# EAGLE design revision1-has-mistakes (EAGLE 6.6.0)
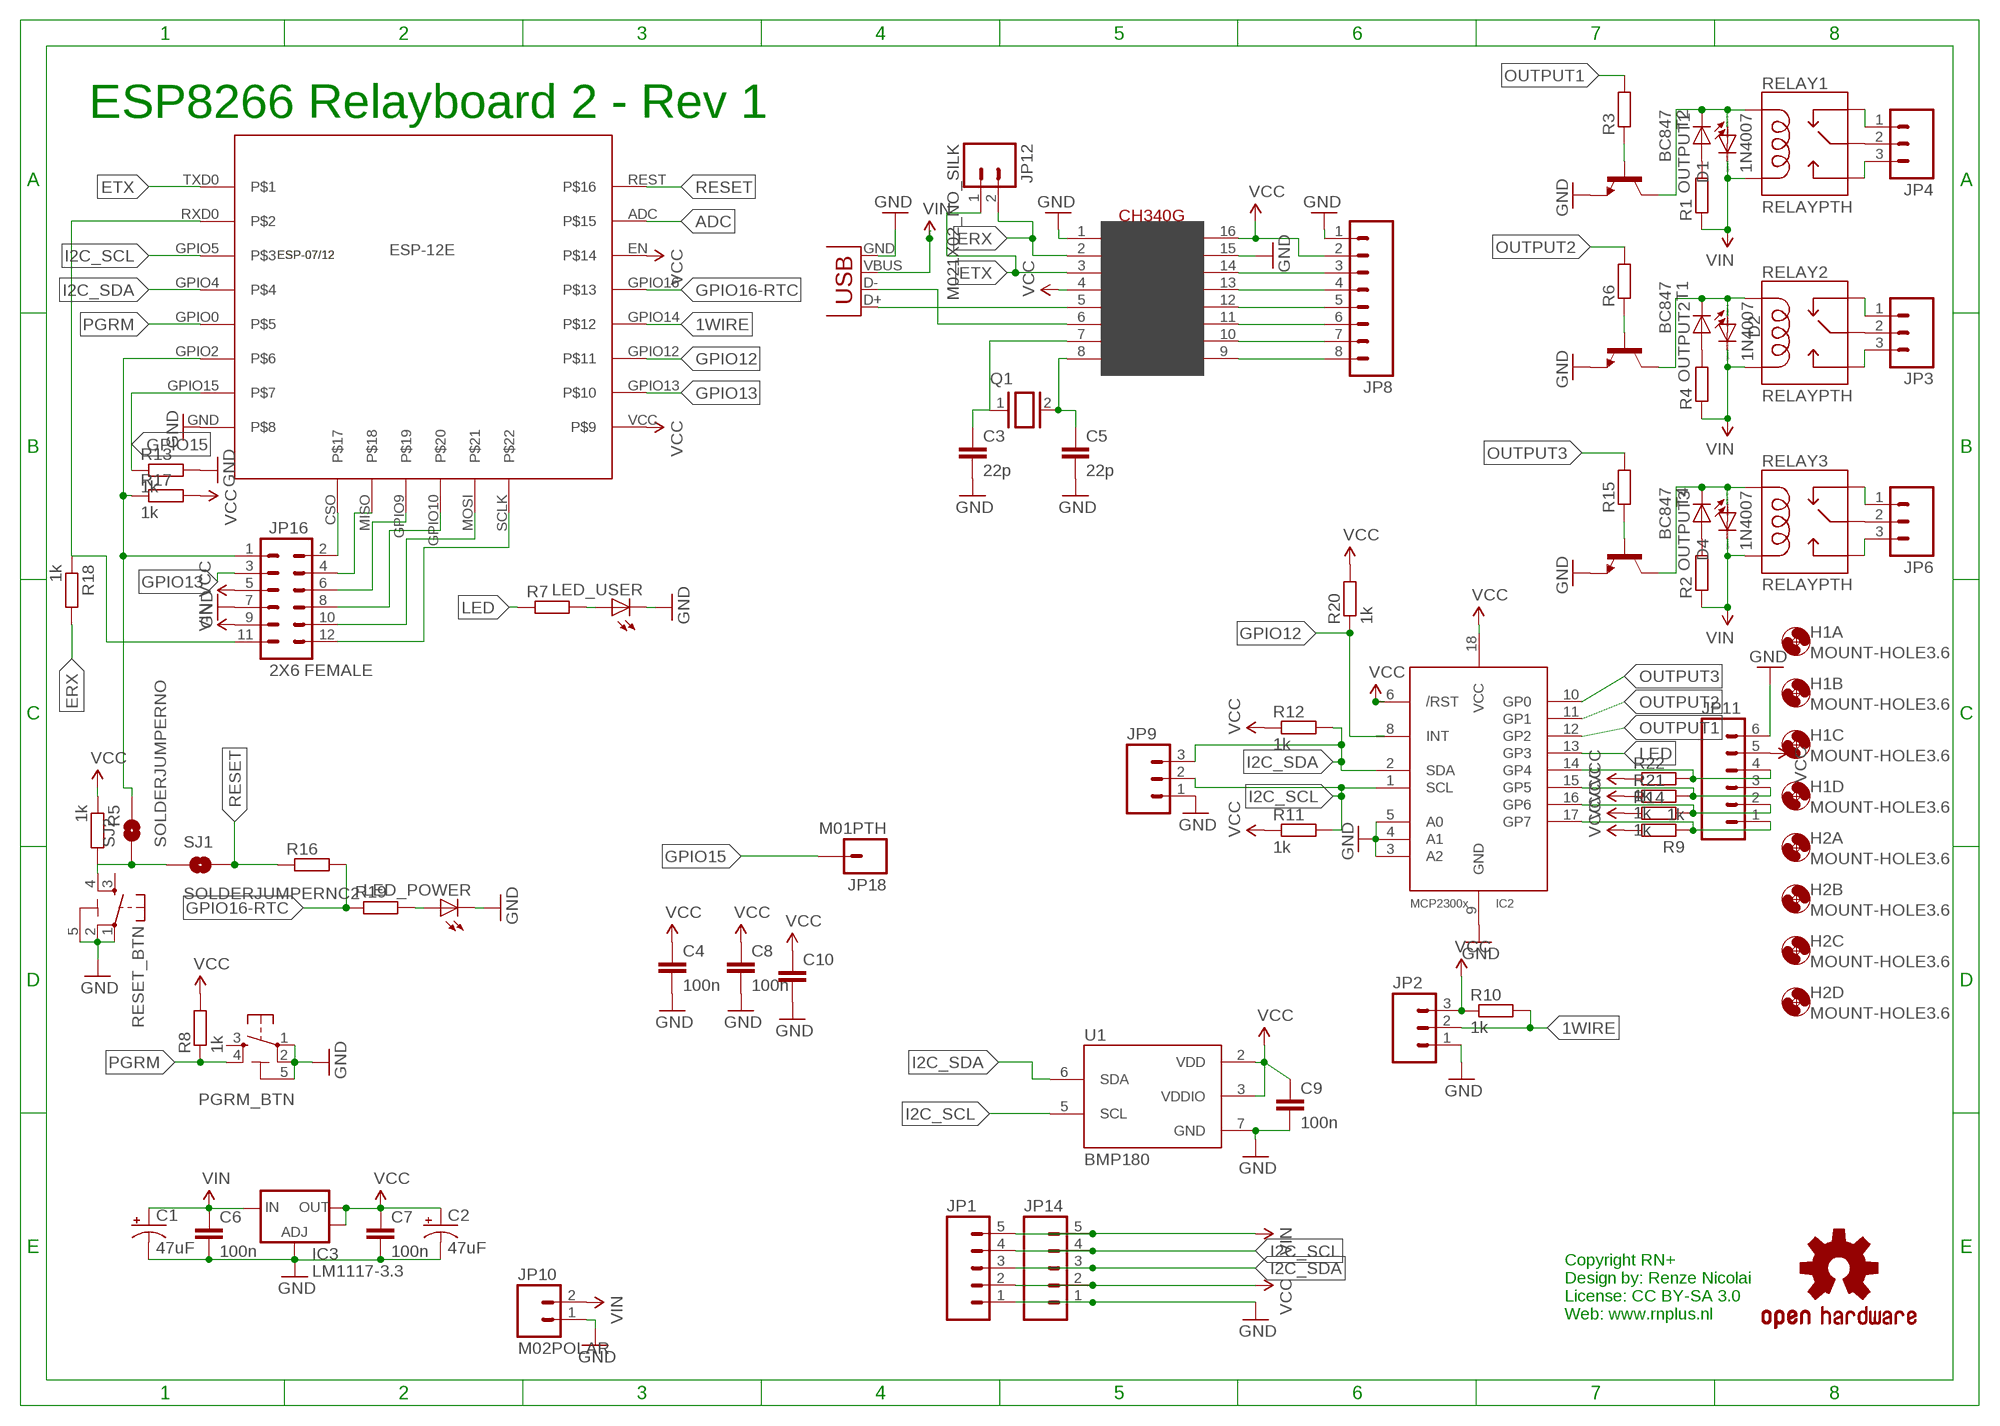
[diagram p0: schematic, sheet 1]

## Parts
C1  47uF  CAP_POLD  [PANASONIC_D]
C2  47uF  CAP_POLD  [PANASONIC_D]
C3  22p  C-EUC0805K  [C0805K]
C4  100n  C-EUC0805K  [C0805K]
C5  22p  C-EUC0805K  [C0805K]
C6  100n  C-EUC0805K  [C0805K]
C7  100n  C-EUC0805K  [C0805K]
C8  100n  C-EUC0805K  [C0805K]
C9  100n  C-EUC0805K  [C0805K]
C10  C-EUC0805K  [C0805K]
D1  1N4942  [DO41-10]
D2  1N4942  [DO41-10]
D4  1N4942  [DO41-10]
H1A  MOUNT-HOLE3.6  [3,6]
H1B  MOUNT-HOLE3.6  [3,6]
H1C  MOUNT-HOLE3.6  [3,6]
H1D  MOUNT-HOLE3.6  [3,6]
H2A  MOUNT-HOLE3.6  [3,6]
H2B  MOUNT-HOLE3.6  [3,6]
H2C  MOUNT-HOLE3.6  [3,6]
H2D  MOUNT-HOLE3.6  [3,6]
IC2  MCP23008/SO  [SO18W]
IC3  LM1117-3.3  V_REG_LM1117SOT223  [SOT223]
JP1  M05PTH  [1X05]
JP2  M03LONGPADS  [1X03_LONGPADS]
JP3  M03-SCREW-5MM  [SCREWTERMINAL-5MM-3]
JP4  M03-SCREW-5MM  [SCREWTERMINAL-5MM-3]
JP5  USB-B  USBPTH  [USB-B-PTH]
JP6  M03-SCREW-5MM  [SCREWTERMINAL-5MM-3]
JP8  M08SILK_FEMALE_PTH  [1X08]
JP9  M031X03_NO_SILK  [1X03_NO_SILK]
JP10  M02POLAR  [MOLEX-1X2]
JP11  M06LONGPADS  [1X06_LONGPADS]
JP12  M021X02_NO_SILK  [1X02_NO_SILK]
JP14  M05PTH  [1X05]
JP16  2X6 FEMALE  M06X2PTH_FEMALE  [2X6]
JP18  M01PTH  [1X01]
LED_POWER  LEDCHIP-LED0805  [CHIP-LED0805]
LED_USER  LEDCHIP-LED0805  [CHIP-LED0805]
LOGO1  OSHW-LOGOL  [OSHW-LOGO-L]
OUTPUT1  LEDCHIP-LED0805  [CHIP-LED0805]
OUTPUT2  LEDCHIP-LED0805  [CHIP-LED0805]
OUTPUT3  LEDCHIP-LED0805  [CHIP-LED0805]
PGRM_BTN  SMARTPRJ_TS42  [SMARTPRJ_TS42]
Q1  XTAL/S  [QS]
R1  SMARTPRJ_R-EU_M0805  [SMARTPRJ_M0805]
R2  SMARTPRJ_R-EU_M0805  [SMARTPRJ_M0805]
R3  SMARTPRJ_R-EU_M0805  [SMARTPRJ_M0805]
R4  SMARTPRJ_R-EU_M0805  [SMARTPRJ_M0805]
R5  1k  SMARTPRJ_R-EU_M0805  [SMARTPRJ_M0805]
R6  SMARTPRJ_R-EU_M0805  [SMARTPRJ_M0805]
R7  SMARTPRJ_R-EU_M0805  [SMARTPRJ_M0805]
R8  1k  SMARTPRJ_R-EU_M0805  [SMARTPRJ_M0805]
R9  1k  SMARTPRJ_R-EU_M0805  [SMARTPRJ_M0805]
R10  1k  SMARTPRJ_R-EU_M0805  [SMARTPRJ_M0805]
R11  1k  SMARTPRJ_R-EU_M0805  [SMARTPRJ_M0805]
R12  1k  SMARTPRJ_R-EU_M0805  [SMARTPRJ_M0805]
R13  1k  SMARTPRJ_R-EU_M0805  [SMARTPRJ_M0805]
R14  1k  SMARTPRJ_R-EU_M0805  [SMARTPRJ_M0805]
R15  SMARTPRJ_R-EU_M0805  [SMARTPRJ_M0805]
R16  SMARTPRJ_R-EU_M0805  [SMARTPRJ_M0805]
R17  1k  SMARTPRJ_R-EU_M0805  [SMARTPRJ_M0805]
R18  1k  SMARTPRJ_R-EU_M0805  [SMARTPRJ_M0805]
R19  SMARTPRJ_R-EU_M0805  [SMARTPRJ_M0805]
R20  1k  SMARTPRJ_R-EU_M0805  [SMARTPRJ_M0805]
R21  1k  SMARTPRJ_R-EU_M0805  [SMARTPRJ_M0805]
R22  1k  SMARTPRJ_R-EU_M0805  [SMARTPRJ_M0805]
RELAY1  RELAYPTH  [SRD-05VDC-SL-C]
RELAY2  RELAYPTH  [SRD-05VDC-SL-C]
RELAY3  RELAYPTH  [SRD-05VDC-SL-C]
RESET_BTN  SMARTPRJ_TS42  [SMARTPRJ_TS42]
SJ1  SOLDERJUMPERNC2  [SJ_2S-NOTRACE]
SJ2  SOLDERJUMPERNO  [SJ_2S-NO]
T1  BC847  [SOT23]
T2  BC847  [SOT23]
T4  BC847  [SOT23]
U1  BMP180  [BMP180]
U$1  CH340G  [SOIC16]
U$2  ESP-07/12_ESP-12E  [ESP-07/12]

## Nets
1WIRE: JP2.2 R10.2 U$2.GPIO14
ADC: U$2.ADC
ERX: JP12.2 R18.2 U$1.2(TX)
ERXR: JP16.11 R18.1 U$2.RXD0
ETX: JP12.1 U$1.3(RX) U$2.TXD0
GND: C1.- C2.- C3.2 C4.2 C5.2 C6.2 C7.2 C8.2 C9.2 C10.2 IC2.3(A2) IC2.4(A1) IC2.5(A0) IC2.9(GND) IC3.1(ADJ) JP1.1 JP2.1 JP5.GND JP8.1 JP9.1 JP10.1 JP11.6 JP14.1 JP16.7 LED_POWER.C LED_USER.C PGRM_BTN.1 PGRM_BTN.2 PGRM_BTN.5(5-GND) R13.2 RESET_BTN.1 RESET_BTN.2 RESET_BTN.5(5-GND) T1.2(E) T2.2(E) T4.2(E) U1.7(GND) U$1.1(GND) U$1.15(RS232) U$2.GND
GPIO12: IC2.8(INT) R20.1 U$2.GPIO12
GPIO13: JP16.3 U$2.GPIO13
GPIO15: JP18.1 R13.1 U$2.GPIO15
GPIO16-RTC: R16.2 R19.1 U$2.GPIO16
I2C_SCL: IC2.1(SCL) JP1.4 JP9.2 JP14.4 R11.2 U1.5(SCL) U$2.GPIO5
I2C_SDA: IC2.2(SDA) JP1.3 JP9.3 JP14.3 R12.2 U1.6(SDA) U$2.GPIO4
LED: IC2.13(GP3) R7.1
N$1: D2.A OUTPUT2.C RELAY2.COIL1 T1.3(C)
N$2: D1.A OUTPUT1.C RELAY1.COIL1 T2.3(C)
N$3: JP3.2 RELAY2.SWCOMMON
N$4: JP4.2 RELAY1.SWCOMMON
N$5: JP4.1 RELAY1.SWCLOSED(SWCLOSE)
N$6: JP4.3 RELAY1.SWOPEN
N$7: JP3.3 RELAY2.SWOPEN
N$8: JP3.1 RELAY2.SWCLOSED(SWCLOSE)
N$9: R3.1 T2.1(B)
N$10: R6.1 T1.1(B)
N$11: R5.2 RESET_BTN.4 SJ1.1 SJ2.1
N$13: OUTPUT2.A R4.2
N$14: IC2.14(GP4) JP11.4 R22.2
N$16: LED_USER.A R7.2
N$17: OUTPUT1.A R1.2
N$20: D4.A OUTPUT3.C RELAY3.COIL1 T4.3(C)
N$21: R15.1 T4.1(B)
N$27: IC2.15(GP5) JP11.3 R21.2
N$38: C3.1 Q1.1 U$1.7(XI)
N$39: OUTPUT3.A R2.2
N$41: C5.1 Q1.2 U$1.8(XO)
N$42: JP6.2 RELAY3.SWCOMMON
N$44: JP6.1 RELAY3.SWCLOSED(SWCLOSE)
N$45: JP6.3 RELAY3.SWOPEN
N$46: JP8.5 U$1.12(DCD)
N$47: JP8.4 U$1.13(DTR)
N$48: JP8.3 U$1.14(RTS)
N$49: JP8.8 U$1.9(CTS)
N$50: JP8.7 U$1.10(DSR)
N$51: JP8.6 U$1.11(RI)
N$56: LED_POWER.A R19.2
N$60: JP16.2 U$2.CSO
N$61: JP16.4 U$2.MISO
N$63: JP16.6 U$2.GPIO9
N$64: JP16.8 U$2.GPIO10
N$65: JP16.10 U$2.MOSI
N$66: JP16.12 U$2.SCLK
N$69: JP16.1 R17.1 SJ2.2 U$2.GPIO2
OUTPUT1: IC2.12(GP2) R3.2
OUTPUT2: IC2.11(GP1) R6.2
OUTPUT3: IC2.10(GP0) R15.2
PGRM: PGRM_BTN.4 R8.1 U$2.GPIO0
RESET: R16.1 SJ1.2 U$2.REST
SENSOR1: IC2.16(GP6) JP11.2 R14.2
SENSOR2: IC2.17(GP7) JP11.1 R9.1
USB_N: JP5.D- U$1.6(D-)
USB_P: JP5.D+ U$1.5(D+)
VCC: C2.+ C4.1 C7.1 C8.1 C9.1 C10.1 IC2.6(/RST) IC2.18(VCC) IC3.2(OUT) IC3.4(OUT) JP1.2 JP2.3 JP8.2 JP11.5 JP14.2 JP16.5 R5.1 R8.2 R9.2 R10.1 R11.1 R12.1 R14.1 R17.2 R20.2 R21.1 R22.1 U1.2(VDD) U1.3(VDDIO) U$1.4(V3) U$1.16(VCC) U$2.EN U$2.VCC
VIN: C1.+ C6.1 D1.C D2.C D4.C IC3.3(IN) JP1.5 JP5.VBUS JP10.2 JP14.5 JP16.9 R1.1 R2.1 R4.1 RELAY1.COIL0 RELAY2.COIL0 RELAY3.COIL0
Unconnected: PGRM_BTN.3 RESET_BTN.3

## Notes on the sheet
- ESP8266 Relayboard 2 - Rev 1
- 1N4007
- 1N4007
- 1N4007
- Copyright RN+
  Design by: Renze Nicolai
  License: CC BY-SA 3.0
  Web: www.rnplus.nl

## Library data of the parts
C1 C2 = SparkFun-Capacitors:CAP_POL: Capacitor Polarized These are standard SMD and PTH capacitors. Normally 10uF, 47uF, and 100uF in electrolytic and tantalum varieties. Always verify the external diameter of the through hole cap, it varies with capacity, voltage, and manufacturer. The EIA devices should be standard.
C3-C10 = rcl:C-EU: CAPACITOR, European symbol
D1 D2 D4 = diode:1N4942: DIODE 1.0 A, 200 V, 150 ns
H1A H1B H1C H1D H2A H2B H2C H2D = holes:MOUNT-HOLE: MOUNTING HOLE with drill center marker
IC2 = adafruit:MCP23008: MCP23008 Inexpensive i2c i/o expander - 8 general purpose i/o pins with optional pullups
IC3 = SparkFun-PowerIC:V_REG_LM1117: Voltage Regulator LM1117 Standard adjustable voltage regulator but in SMD form. Spark Fun Electronics SKU : COM-00595
JP1 JP14 = SparkFun-Connectors:M05: Header 5 Standard 5-pin 0.1" header. Use with straight break away headers (SKU : PRT-00116), right angle break away headers (PRT-00553), swiss pins (PRT-00743), machine pins (PRT-00117), and female headers (PRT-00115). Molex polarized connector foot print use with SKU : PRT-08230 with associated crimp pins and housings.
JP2 JP9 = SparkFun-Connectors:M03: Header 3 Standard 3-pin 0.1" header. Use with straight break away headers (SKU : PRT-00116), right angle break away headers (PRT-00553), swiss pins (PRT-00743), machine pins (PRT-00117), and female headers (PRT-00115). Molex polarized connector foot print use with SKU : PRT-08232 with associated crimp pins and housings.
JP3 JP4 JP6 = SparkFun-Connectors:M03: Header 3 Standard 3-pin 0.1" header. Use with straight break away headers (SKU : PRT-00116), right angle break away headers (PRT-00553), swiss pins (PRT-00743), machine pins (PRT-00117), and female headers (PRT-00115). Molex polarized connector foot print use with SKU : PRT-08232 with associated crimp pins and housings.; STOREFRONT_ID: PRT-08433
JP5 = SparkFun-Connectors:USB: USB Connectors USB-B-PTH is fully proven SKU : PRT-00139/CONN-08278 USB-miniB is fully proven SKU : PRT-00587 USB-A-PCB is untested. USB-A-H is throughly reviewed, but untested. Spark Fun Electronics SKU : PRT-00437 USB-B-SMT is throughly reviewed, but untested. Needs silkscreen touching up. USB-A-S has not been used/tested USB-MB-H has not been used/tested USB-MICROB has been used. CONN-09505; PROD_ID: CONN-08278
JP8 = SparkFun-Connectors:M08: Header 8 Standard 8-pin 0.1" header. Use with straight break away headers (SKU : PRT-00116), right angle break away headers (PRT-00553), swiss pins (PRT-00743), machine pins (PRT-00117), and female headers (PRT-00115).; PROD_ID: CONN-08438
JP10 JP12 = SparkFun-Connectors:M02: Standard 2-pin 0.1" header. Use with - straight break away headers ( PRT-00116) - right angle break away headers (PRT-00553) - swiss pins (PRT-00743) - machine pins (PRT-00117) - female headers (PRT-00115) Molex polarized connector foot print use with: PRT-08233 with associated crimp pins and housings. 2.54_SCREWTERM for use with PRT-10571. 3.5mm Screw Terminal footprints for PRT-08084 5mm Screw Terminal footprints for use with PRT-08432
JP11 = SparkFun-Connectors:M06: Header 6 Standard 6-pin 0.1" header. Use with straight break away headers (SKU : PRT-00116), right angle break away headers (PRT-00553), swiss pins (PRT-00743), machine pins (PRT-00117), and female headers (PRT-00115). Molex polarized connector foot print use with SKU : PRT-08094 with associated crimp pins and housings. NOTES ON THE VARIANTS LOCK and LOCK_LONGPADS... This footprint was designed to help hold the alignment of a through-hole component (i.e. 6-pin header) while soldering it into place. You may notice that each hole has been shifted either up or down by 0.005 of an inch from it's more standard position (which is a perfectly straight line). This slight alteration caused the pins (the squares in the middle) to touch the edges of the holes. Because they are alternating, it causes a "brace" to hold the component in place. 0.005 has proven to be the perfect amount of "off-center" position when using our standard breakaway headers. Although looks a little odd when you look at the bare footprint, once you have a header in there, the alteration is very hard to notice. Also,if you push a header all the way into place, it is covered up entirely on the bottom side. This idea of altering the position of holes to aid alignment will be further integrated into the Sparkfun Library for other footprints. It can help hold any component with 3 or more connection pins.
JP16 = SparkFun-Connectors:M06X2; PROD_ID: CONN-12423
JP18 = SparkFun-Connectors:M01: Header 1 Standard 1-pin 0.1" header. Use with straight break away headers (SKU : PRT-00116), right angle break away headers (PRT-00553), swiss pins (PRT-00743), machine pins (PRT-00117), and female headers (PRT-00115).
LED_POWER LED_USER OUTPUT1-OUTPUT3 = led:LED: LED OSRAM: - CHIPLED LG R971, LG N971, LY N971, LG Q971, LY Q971, LO R971, LY R971 LH N974, LH R974 LS Q976, LO Q976, LY Q976 LO Q996 - Hyper CHIPLED LW Q18S LB Q993, LB Q99A, LB R99A - SideLED LS A670, LO A670, LY A670, LG A670, LP A670 LB A673, LV A673, LT A673, LW A673 LH A674 LY A675 LS A676, LA A676, LO A676, LY A676, LW A676 LS A679, LY A679, LG A679 - Hyper Micro SIDELED® LS Y876, LA Y876, LO Y876, LY Y876 LT Y87S - SmartLED LW L88C, LW L88S LB L89C, LB L89S, LG L890 LS L89K, LO L89K, LY L89K LS L896, LA L896, LO L896, LY L896 - TOPLED LS T670, LO T670, LY T670, LG T670, LP T670 LSG T670, LSP T670, LSY T670, LOP T670, LYG T670 LG T671, LOG T671, LSG T671 LB T673, LV T673, LT T673, LW T673 LH T674 LS T676, LA T676, LO T676, LY T676, LB T676, LH T676, LSB T676, LW T676 LB T67C, LV T67C, LT T67C, LS T67K, LO T67K, LY T67K, LW E67C LS E67B, LA E67B, LO E67B, LY E67B, LB E67C, LV E67C, LT E67C LW T67C LS T679, LY T679, LG T679 LS T770, LO T770, LY T770, LG T770, LP T770 LB T773, LV T773, LT T773, LW T773 LH T774 LS E675, LA E675, LY E675, LS T675 LS T776, LA T776, LO T776, LY T776, LB T776 LHGB T686 LT T68C, LB T68C - Hyper Mini TOPLED® LB M676 - Mini TOPLED Santana® LG M470 LS M47K, LO M47K, LY M47K Source: http://www.osram.convergy.de LUXEON: - LUMILED® LXK2-PW12-R00, LXK2-PW12-S00, LXK2-PW14-U00, LXK2-PW14-V00 LXK2-PM12-R00, LXK2-PM12-S00, LXK2-PM14-U00 LXK2-PE12-Q00, LXK2-PE12-R00, LXK2-PE12-S00, LXK2-PE14-T00, LXK2-PE14-U00 LXK2-PB12-K00, LXK2-PB12-L00, LXK2-PB12-M00, LXK2-PB14-N00, LXK2-PB14-P00, LXK2-PB14-Q00 LXK2-PR12-L00, LXK2-PR12-M00, LXK2-PR14-Q00, LXK2-PR14-R00 LXK2-PD12-Q00, LXK2-PD12-R00, LXK2-PD12-S00 LXK2-PH12-R00, LXK2-PH12-S00 LXK2-PL12-P00, LXK2-PL12-Q00, LXK2-PL12-R00 Source: www.luxeon.com KINGBRIGHT: KA-3528ASYC Source: www.kingbright.com
LOGO1 = SparkFun-Aesthetics:OSHW-LOGO: Open Source Hardware Logo This logo indicates the piece of hardware it is found on incorporates a OSHW license and/or adheres to the definition of open source hardware found here: http://freedomdefined.org/OSHW
PGRM_BTN RESET_BTN = arduino_Uno_Rev3-02-TH:SMARTPRJ_TS42: TS42 Dongnan Electronics Tact switch VDC 12V - 50mA
Q1 = special:XTAL/S: CRYSTAL
R1-R22 = arduino_Uno_Rev3-02-TH:SMARTPRJ_R-EU_: RESISTOR, European symbol
RELAY1-RELAY3 = srd-05vdc-sl-c:RELAY: SPDT relay (COM-00101)
SJ1 SJ2 = SparkFun-Retired:SOLDERJUMPER: Solder Jumper Standard SMD solder jumper. Used to automate production. Two varients : Normally Open and Normally Closed are the same, but have different paste layers. NC will have a large amount of paste and should jumper during reflow.
T1 T2 T4 = transistor:BC847: NPN TRANSISTOR
U1 = SparkFun-Sensors:BMP180: BOSCH BMP180 DIGITAL BAROMETRIC PRESSURE SENSOR Web page: http://www.bosch-sensortec.com/en/homepage/products_3/environmental_sensors_1/bmp180_1/bmp180 Datasheet: http://ae-bst.resource.bosch.com/media/products/dokumente/bmp180/BST-BMP180-DS000-09.pdf The BMP180 is the function compatible successor of the BMP085, a new generation of high precision digital pressure sensors for consumer applications. The ultra-low power, low voltage electronics of the BMP180 is optimized for use in mobile phones, PDAs, GPS navigation devices and outdoor equipment. With a low altitude noise of merely 0.25m at fast conversion time, the BMP180 offers superior performance. The I2C interface allows for easy system integration with a microcontroller. The BMP180 is based on piezo-resistive technology for EMC robustness, high accuracy and linearity as well as long term stability. Key features: - Temperature measurement included - I2C interface - Fully calibrated - Pb-free, halogen-free and RoHS compliant, - MSL 1 Basic specs: Pressure range: 300 to 1100hPa (+9000m to -500m relating to sea level) Supply voltage: 1.8 to 3.6V (VDD), 1.62V to 3.6V (VDDIO) Package: LGA package with metal lid Small footprint: 3.6mm x 3.8mm Super-flat: 0.93mm height Low power: 5μA at 1 sample / sec. in standard mode Low noise: 0.06hPa (0.5m) in ultra low power mode, 0.02hPa (0.17m) advanced resolution mode Typical applications: - Enhancement of GPS navigation (dead-reckoning, slope detection, etc.) - In- and out-door navigation - Leisure and sports - Weather forecast - Vertical velocity indication (rise/sink speed)
U$1 = usb-serial:CH340G
U$2 = ESP-12E:ESP-07/12: Version 1.0 of the library for the ESP-07/12 full GPIO dev board module byME Jon jonnyradu@gmail.com

## Net classes
0 default: clearance 0.205 mm

## Board
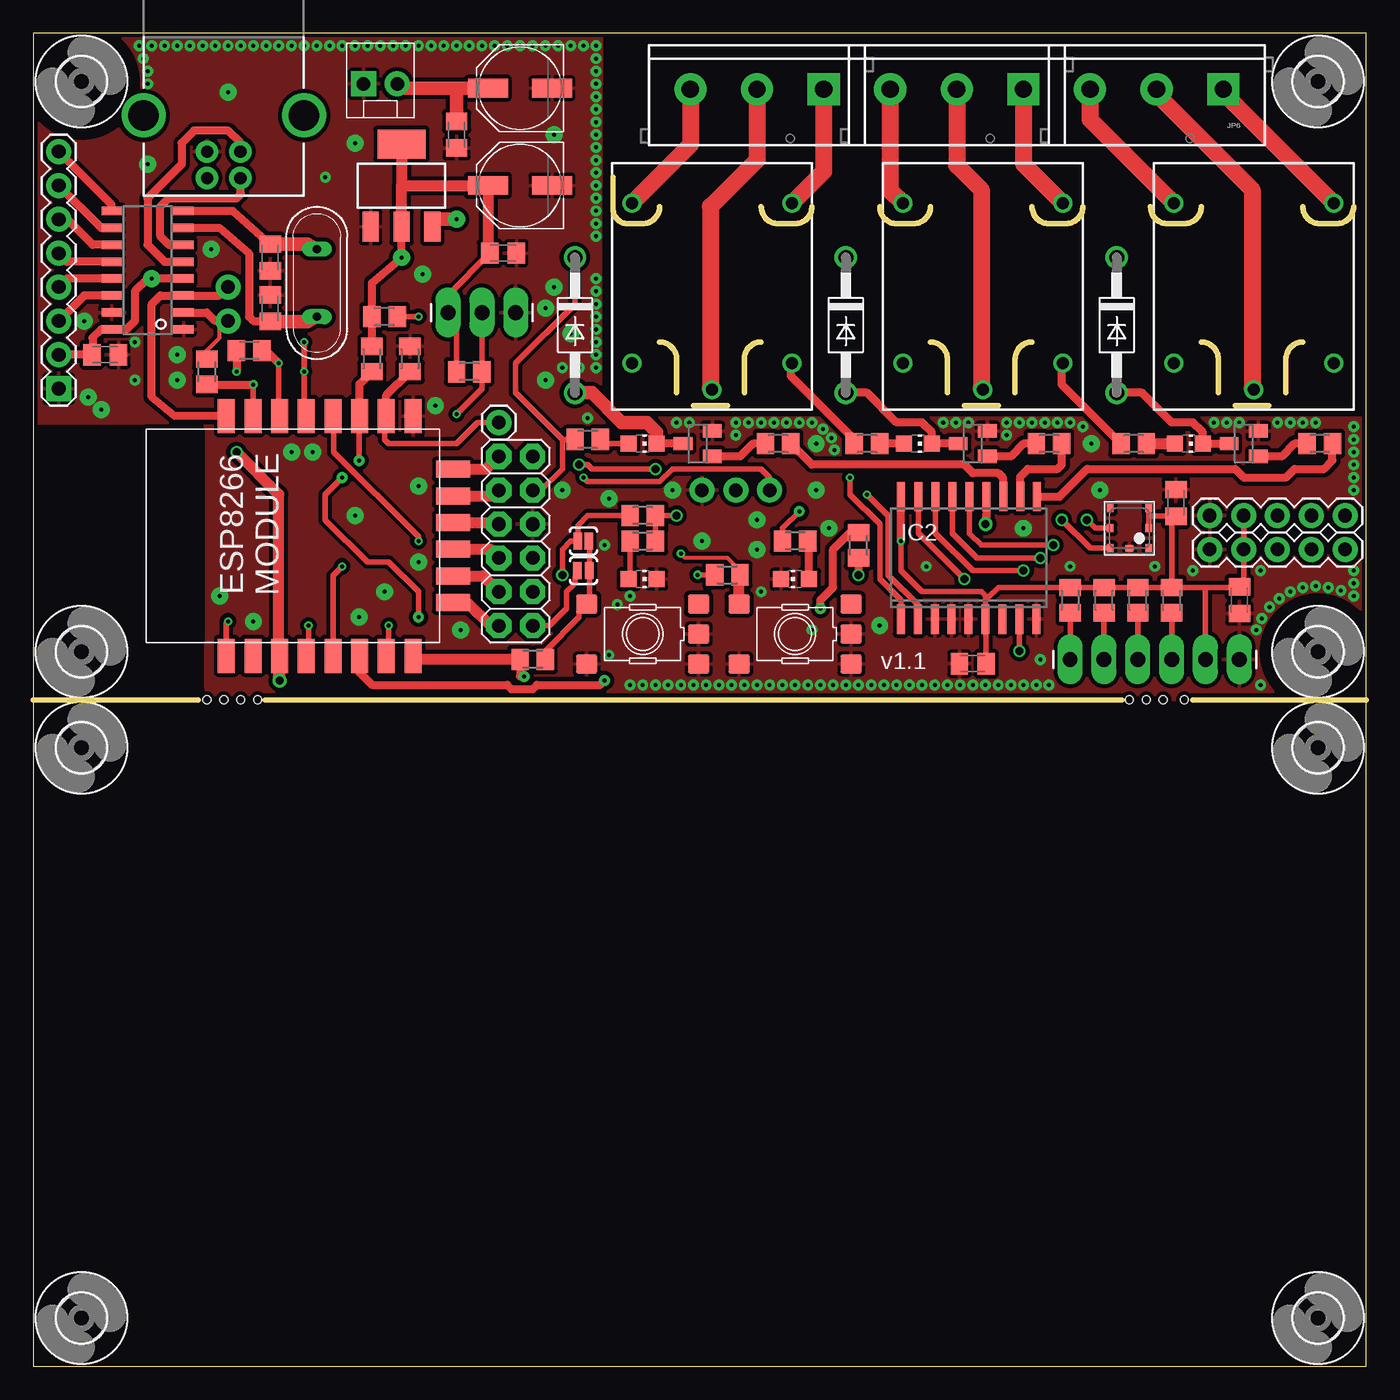
[diagram p1: board, top side]
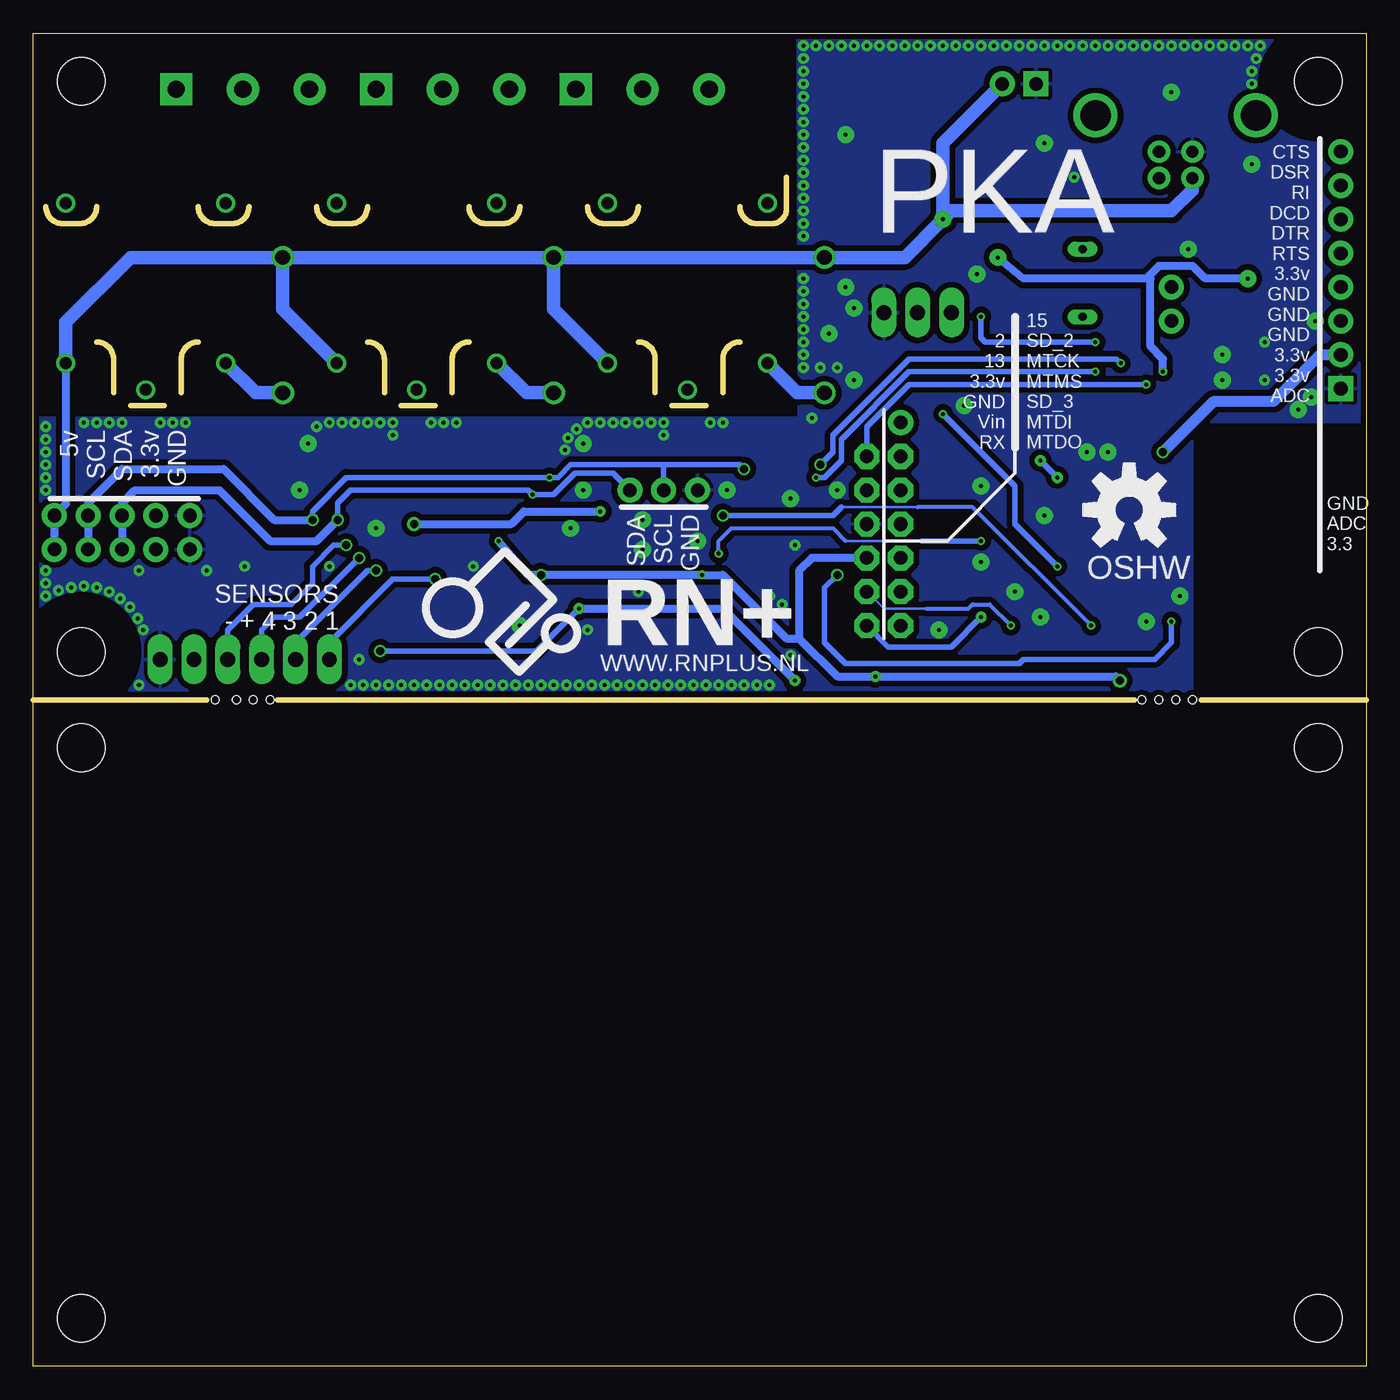
[diagram p2: board, bottom side, seen from below]

Size 100 x 100 mm. Coordinates in mm from the lower left corner, seen from the top.
Outline: 100,50 100,0 0,0 0,50
Outline: 100,50 100,100 0,100 0,50
Outline: 58.42,87 arc-90 57.15,85.72 55.88,85.72 arc-90 54.61,87
Outline: 46.99,87 arc-90 45.72,85.72 44.45,85.72 arc-90 43.5,87 43.5,89.22
Outline: 53.34,73.03 53.34,75.56 arc-90 54.61,76.83
Outline: 48.26,73.03 48.26,75.56 arc90 46.99,76.83
Outline: 68.58,73.03 68.58,75.56 arc90 67.31,76.83
Outline: 73.66,73.03 73.66,75.56 arc-90 74.93,76.83
Outline: 67.31,87 arc-90 66.04,85.72 64.77,85.72 arc-90 63.5,87
Outline: 78.74,87 arc-90 77.47,85.72 76.2,85.72 arc-90 74.93,87
Outline: 83.82,87 arc90 85.09,85.72 86.36,85.72 arc90 87.63,87
Outline: 99.06,87 arc-90 97.79,85.72 96.52,85.72 arc-90 95.25,87
Outline: 88.9,73.03 88.9,75.56 arc90 87.63,76.83
Outline: 93.98,73.03 93.98,75.56 arc-90 95.25,76.83
Outline: 12.38,50 0,50
Outline: 17.38,50 81.67,50
Outline: 100,50 86.98,50
Outline: 52.07,72.07 49.53,72.07
Outline: 72.39,72.07 69.85,72.07
Outline: 92.71,72.07 90.17,72.07
Copper layers (1*16): Top 0.035mm / dielectric 1.5mm / Bottom 0.035mm
Design rules "dirt_cheap_dirty_boards.v1": minimum track width 5mil, minimum drill 12mil, track to track 5mil, track to pad 5mil, pad to pad 5mil, via to via 5mil, smd to smd 0mil, copper to edge 10mil, drill to drill 10mil, minimum pad ring 10mil, minimum via ring 6mil, stop-mask expansion 2mil, vias tented up to drill 25mil, thermal gap 10mil
Holes 0.6 mm at 13.02,50 14.29,50 15.56,50 82.23,50 83.5,50 16.83,50 84.77,50 86.36,50
tRestrict: area 0,50.8 to 12.5,70.3
bRestrict: area 0,50.8 to 12.5,70.3

### Footprints (pad centres in the part's own frame; a part is rotated, then mirrored left to right if it is on the bottom)
PANASONIC_D = smd 3 x 1.4: + 2.4,0; - -2.4,0
C0805K = smd 1.3 x 1.6: 1 -1,0; 2 1,0
DO41-10 = drill 1.118: A 5.08,0; C -5.08,0
3,6 = hole 3.6: 0,0
SO18W = smd 0.6 x 2.2: 1 -4.445,-4.6; 2 -3.175,-4.6; 3 -1.905,-4.6; 4 -0.635,-4.6; 5 0.635,-4.6; 6 1.905,-4.6; 7 3.175,-4.6; 8 4.445,-4.6; 9 5.715,-4.6; 10 5.775,4.6; 11 4.505,4.6; 12 3.235,4.6; 13 1.965,4.6; 14 0.695,4.6; 15 -0.575,4.6; 16 -1.845,4.6; 17 -3.145,4.6; 18 -4.445,4.6
SOT223 = smd 1.219 x 2.235: 1 -2.311,-3.099; 2 0,-3.099; 3 2.311,-3.099 | smd 3.6 x 2.2: 4 0,3.099
1X05 = drill 1.016 pad 1.88: 1 0,0; 2 2.54,0; 3 5.08,0; 4 7.62,0; 5 10.16,0
1X03_LONGPADS = drill 1.118 pad 1.88 long: 1 0,0; 2 2.54,0; 3 5.08,0
SCREWTERMINAL-5MM-3 = drill 1.3 pad 2.413 square: 1 0,0 | drill 1.3 pad 2.413: 2 5,0; 3 10,0
USB-B-PTH = drill 0.914 pad 1.676: D+ 0,1.25; D- 1.981,1.25; GND 0,-1.25; VBUS 1.981,-1.25 | drill 2.286: S1 -2.718,-6.02; S2 -2.718,6.02
1X08 = drill 1.016 pad 1.88 square: 1 0,0 | drill 1.016 pad 1.88: 2 2.54,0; 3 5.08,0; 4 7.62,0; 5 10.16,0; 6 12.7,0; 7 15.24,0; 8 17.78,0
1X03_NO_SILK = drill 1.016 pad 1.88: 1 0,0; 2 2.54,0; 3 5.08,0
MOLEX-1X2 = drill 1.016 pad 1.88 square: 1 0,0 | drill 1.016 pad 1.88: 2 2.54,0
1X06_LONGPADS = drill 1.118 pad 1.88 long: 1 0,0; 2 2.54,0; 3 5.08,0; 4 7.62,0; 5 10.16,0; 6 12.7,0
1X02_NO_SILK = drill 1.016 pad 1.88: 1 0,0; 2 2.54,0
2X6 = drill 1.016 pad 1.88 octagon: 1 0,0; 2 0,2.54; 3 2.54,0; 4 2.54,2.54; 5 5.08,0; 6 5.08,2.54; 7 7.62,0; 8 7.62,2.54; 9 10.16,0; 10 10.16,2.54; 11 12.7,0; 12 12.7,2.54
1X01 = drill 1.016 pad 1.88: 1 0,0
CHIP-LED0805 = smd 1.2 x 1.2: A 0,-1.05; C 0,1.05
SMARTPRJ_TS42 = smd 1.6 x 1.4: 1 -4.2,2.25; 2 4.2,2.25; 3 -4.2,-2.25; 4 4.2,-2.25; 5 -4.2,0
QS = drill 0.61 long: 1 -2.54,0; 2 2.54,0
SMARTPRJ_M0805 = smd 1.3 x 1.6: 1 -0.95,0; 2 0.95,0
SRD-05VDC-SL-C = drill 0.9: COIL0 -5.39,-6.12; COIL1 -5.39,5.88; SWCLOSED 6.61,-6.12; SWCOMMON -7.39,-0.12; SWOPEN 6.61,5.88
SJ_2S-NOTRACE = smd 0.635 x 1.27: 1 -0.401,0; 2 0.413,0
SJ_2S-NO = smd 0.635 x 1.27: 1 -0.45,0; 2 0.45,0
SOT23 = smd 1 x 1.4: 1 -0.95,-1.1; 2 0.95,-1.1; 3 0,1.1
BMP180 = smd 0.6 x 0.5: 1 1.5,1.45; 2 0,1.45; 3 -1.5,1.45; 4 -1.5,-1.45; 5 0,-1.45; 6 1.5,-1.45 | smd 0.5 x 0.6: 7 1.5,0
SOIC16 = smd 0.635 x 1.524: 1 -4.445,-2.695; 2 -3.175,-2.695; 3 -1.905,-2.695; 4 -0.635,-2.695; 5 0.635,-2.695; 6 1.905,-2.695; 7 3.175,-2.695; 8 4.445,-2.695; 9 4.445,2.695; 10 3.175,2.695; 11 1.905,2.695; 12 0.635,2.695; 13 -0.635,2.695; 14 -1.905,2.695; 15 -3.175,2.695; 16 -4.445,2.695
ESP-07/12 = smd 2.54 x 1.27: ADC -1,14; EN -1,12; GND 17,2; GPIO0 17,8; GPIO2 17,6; GPIO4 17,10; GPIO5 17,12; GPIO12 -1,6; GPIO13 -1,4; GPIO14 -1,8; GPIO15 17,4; GPIO16 -1,10; REST -1,16; RXD0 17,14; TXD0 17,16; VCC -1,2 | smd 1.27 x 2.54: CSO 3,-1; GPIO9 7,-1; GPIO10 9,-1; MISO 5,-1; MOSI 11,-1; SCLK 13,-1

### Placement (x,y rotation side)
C1  36.51,95.89 180 top
C2  36.51,88.58 180 top
C3  17.78,79.38 90 top
C4  5.4,75.88 0 top
C5  17.78,83.19 270 top
C6  31.75,92.39 270 top
C7  35.24,83.5 0 top
C8  90.49,57.47 270 top
C9  85.72,64.77 90 top
C10  70.48,52.7 180 top
D1  40.64,78.11 270 top
D2  60.96,78.11 270 top
D4  81.28,78.11 270 top
H1A  3.6,3.6 0 top
H1B  96.4,3.6 0 top
H1C  3.6,46.4 0 top
H1D  96.4,46.4 0 top
H2A  3.6,53.6 0 top
H2B  96.4,53.6 0 top
H2C  3.6,96.4 0 top
H2D  96.4,96.4 0 top
IC2  69.53,60.64 0 top
IC3  27.62,88.58 0 top
JP1  88.27,63.82 0 top
JP2  36.2,79.06 180 top
JP3  74.29,95.81 180 top
JP4  59.29,95.81 180 top
JP5  14.29,91.12 270 top
JP6  89.28,95.81 180 top
JP8  1.91,73.34 90 top
JP9  50.16,65.72 0 top
JP10  24.77,96.2 0 top
JP11  77.79,53.02 0 top
JP12  14.61,80.96 270 top
JP14  88.27,61.28 0 top
JP16  37.47,55.56 90 top
JP18  34.92,70.8 0 top
LED_POWER  45.72,59.05 270 top
LED_USER  57.15,59.05 90 top
LOGO1  17.78,64.24 0 bottom
OUTPUT1  45.72,69.22 270 top
OUTPUT2  66.36,69.22 270 top
OUTPUT3  86.68,69.22 270 top
PGRM_BTN  57.15,54.93 180 top
Q1  21.27,81.28 90 top
R1  41.59,69.53 0 top
R2  82.55,69.22 0 top
R3  55.88,69.22 0 top
R4  62.55,69.22 0 top
R5  37.47,53.02 0 top
R6  76.2,69.22 0 top
R7  57.15,61.91 0 top
R8  52.07,59.37 180 top
R9  77.79,57.47 90 top
R10  32.7,74.61 0 top
R11  16.19,76.2 0 top
R12  26.35,78.74 0 top
R13  28.26,75.56 90 top
R14  80.33,57.47 270 top
R15  96.52,69.22 0 top
R16  45.72,63.82 0 top
R17  25.4,75.56 90 top
R18  13.02,74.61 90 top
R19  45.72,61.91 180 top
R20  61.91,61.59 270 top
R21  82.87,57.47 270 top
R22  85.41,57.47 270 top
RELAY1  50.8,80.64 90 top
RELAY2  71.12,80.64 90 top
RELAY3  91.44,80.64 90 top
RESET_BTN  45.72,54.93 180 top
SJ1  41.27,61.91 180 top
SJ2  41.27,59.69 180 top
T1  70.48,69.22 90 top
T2  49.85,69.22 90 top
T4  90.81,69.22 90 top
U1  82.23,62.87 270 top
U$1  8.57,82.23 90 top
U$2  30.48,54.29 90 top

### Tracks (layer width: path | path; a pad name or v marks a point on that pad's centre or on a via)
1WIRE  (via drill 0.3 pad 0.61)
  Top 0.406: U$2.GPIO14 22.48,59.31 v23.18,60.01 | v31.75,71.44 33.66,73.34 33.66,73.66 | 33.66,73.66 JP2.2 | R10.2 33.65,73.66 33.66,73.66
  Bottom 0.406: v31.75,71.44 26.35,66.04 26.35,63.18 v23.18,60.01
ERX
  Top 0.305: R18.2 12.38,75.56 13.97,77.15 13.97,77.79 JP12.2
  Top 0.61: U$1.2 13.02,79.06 13.65,78.42 JP12.2
ERXR  (via drill 0.3 pad 0.61)
  Top 0.406: U$2.RXD0 16.48,73.63 v16.51,73.66
  Top 0.61: R18.1 v16.51,73.66
  Bottom 0.406: v16.51,73.66 34.29,73.66 37.47,70.48 JP16.11
ETX
  Top 0.61: U$2.TXD0 10.62,71.29 8.89,72.71 8.89,79.69 9.53,80.33 U$1.3 13.97,80.33 JP12.1
GND  (via drill 0.3 pad 0.81, 0.3 pad 1.27)
  other vias: 43.18,65.09 14.61,95.57 21.91,89.22 29.21,81.92 63.5,55.56 47.94,65.72 58.74,65.72 38.42,73.98 39.05,80.96 39.05,92.39 79.38,69.22 58.74,69.22 54.29,63.5 26.35,58.1 8.57,90.17 28.89,66.04 19.37,68.58 16.51,55.88 20.95,68.58 24.13,63.82 54.29,61.28 13.97,57.78 13.34,83.82 24.13,91.76 59.69,62.87 76.2,51.12 87,59.69 84.14,60.01 92.08,59.69 74.3,62.87 80.01,65.72 78.74,70.48 52.7,69.85 88.58,70.8 99.06,70.48 8.89,99.06 19.37,99.06 42.23,99.06 28.89,60.33 32.07,55.24 24.45,56.2 43.81,57.15 39.69,65.72 42.23,75.88 10.79,75.88 10.79,73.98 48.26,70.8 77.79,60.01 99.06,66.67 99.06,68.58 99.06,67.63 99.06,69.53 99.06,65.72 99.06,59.69 99.06,58.74 99.06,57.78 98.11,58.2 97.16,58.42 96.2,58.52 95.25,58.42 94.3,58.1 93.48,57.59 92.75,56.96 92.16,56.1 91.76,55.24 92.08,51.12 96.2,70.8 95.25,70.8 94.3,70.8 93.34,70.8 89.53,70.8 90.49,70.8 77.79,70.8 76.83,70.8 75.88,70.8 74.93,70.8 73.98,70.8 73.03,70.8 73.03,69.85 75.25,51.12 74.3,51.12 73.34,51.12 72.39,51.12 71.44,51.12 70.48,51.12 69.53,51.12 68.58,51.12 67.63,51.12 66.67,51.12 65.72,51.12 64.77,51.12 63.82,51.12 62.87,51.12 61.91,51.12 60.96,51.12 60.01,51.12 59.05,51.12 58.1,51.12 57.15,51.12 56.2,51.12 55.24,51.12 54.29,51.12 53.34,51.12 52.39,51.12 51.44,51.12 50.48,51.12 49.53,51.12 48.58,51.12 47.62,51.12 46.67,51.12 45.72,51.12 66.99,60.01 44.77,51.12 58.42,55.24 42.23,98.11 42.23,97.16 42.23,96.2 42.23,95.25 42.23,94.3 42.23,93.34 42.23,92.39 42.23,91.44 42.23,90.49 42.23,89.53 42.23,88.58 42.23,87.63 42.23,86.68 42.23,85.72 42.23,84.77 50.16,61.91 44.77,57.78 42.86,61.59 54.61,58.1 43.18,53.34 42.23,81.6 42.23,80.64 42.23,79.69 42.23,78.74 42.23,77.79 42.23,76.83 42.23,74.93 41.59,71.12 49.21,70.8 58.42,70.8 57.47,70.8 56.52,70.8 55.56,70.8 54.61,70.8 53.66,70.8 52.7,70.8 59.25,70.31 59.88,69.65 60.1,68.75 68.26,70.8 69.22,70.8 70.17,70.8 41.27,99.06 40.32,99.06 39.37,99.06 38.42,99.06 37.47,99.06 36.51,99.06 35.56,99.06 34.61,99.06 33.66,99.06 32.7,99.06 31.75,99.06 30.8,99.06 29.84,99.06 28.89,99.06 27.94,99.06 26.99,99.06 26.04,99.06 25.08,99.06 24.13,99.06 23.18,99.06 22.23,99.06 21.27,99.06 20.32,99.06 18.41,99.06 17.46,99.06 16.51,99.06 15.56,99.06 14.61,99.06 13.65,99.06 12.7,99.06 11.75,99.06 10.79,99.06 9.84,99.06 7.94,99.06 8.26,98.11 8.57,97.16 8.57,96.2 75.56,53.02 4.13,72.71 40.96,74.93 39.69,74.93 38.42,79.38 40.32,77.47 3.81,78.42 30.16,72.07 7.62,73.98 5.08,71.75 7.62,76.83
  pour Top (isolate 0.305): 0,99.92 42.63,99.92 42.55,84.68 42.55,71.12 100.01,71.12 100.01,50 0.08,50.08 0.03,69.98 0,69.98
  pour Bottom (isolate 0.432): 100.01,50 0,50.05 0,69.98 -0.03,69.93 -0.03,70.46 0,99.92 42.63,99.92 42.55,71.12 100.01,71.12
GPIO12  (via drill 0.3 pad 0.81, 0.6 pad 0.81)
  Top 0.406: IC2.8 v73.98,53.66
  Top 0.61: U$2.GPIO12 24.48,52.04 25.4,51.12 35.56,51.12 35.88,50.8 37.47,50.8 37.78,51.12 42.55,51.12 v42.86,51.44 | v59.05,56.83 59.05,57.47 60.01,58.42 60.01,61.28 61.28,62.55 R20.1
  Bottom 0.406: v73.98,53.66 62.23,53.66 v59.05,56.83
  Bottom 0.61: v59.05,56.83 48.26,56.83 v42.86,51.44
GPIO13  (via drill 0.3 pad 0.61)
  Top 0.406: v26.67,55.56 26.67,53.48 U$2.GPIO13
  Bottom 0.2: JP16.3 36.2,56.83 33.02,56.83
  Bottom 0.305: v26.67,55.56 28.26,57.15 29.53,57.15 29.84,56.83 33.02,56.83
GPIO15
  Top 0.406: JP18.1 33.34,70.8 31.75,69.22 26.67,69.22 26.35,69.53 26.35,71.17 U$2.GPIO15
  Top 0.61: U$2.GPIO15 26.48,72.84 R13.1
GPIO16-RTC  (via drill 0.3 pad 0.61, 0.6)
  Top 0.305: 20.64,53.45 U$2.GPIO16
  Top 0.406: v20.64,55.56 20.64,53.45 | R19.1 R16.2 v48.26,63.82
  Bottom 0.2: 33.66,64.45 39.37,64.45
  Bottom 0.305: v20.64,55.56 29.53,64.45 33.66,64.45
  Bottom 0.406: v48.26,63.82 40.01,63.82 39.37,64.45
I2C_SCL  (via drill 0.3 pad 0.61, 0.6)
  Top 0.406: v18.41,75.25 18.41,71.36 U$2.GPIO5 | v61.28,66.67 61.28,65.41 63.5,63.18 63.5,59.05 65.09,57.47 IC2.1 | U1.5 79.69,62.87 v79.06,63.5 | v46.67,67.31 41.91,67.31 41.59,67.63 v40.96,67.63 | R11.2 17.46,76.2
  Top 0.61: 17.46,76.2 v18.41,75.25
  Bottom 0.406: v18.41,75.25 18.73,75.56 34.29,75.56 40.01,69.85 40.01,68.58 v40.96,67.63 | 52.7,67.63 59.69,67.63 60.64,66.67 v61.28,66.67 76.52,66.67 79.06,64.14 v79.06,63.5 | 52.7,67.63 46.99,67.63 v46.67,67.31 | 52.7,67.63 JP9.2
  Bottom 0.61: v79.06,63.5 81.92,63.5 85.72,67.31 93.34,67.31 95.89,64.77 JP1.4 JP14.4
I2C_SDA  (via drill 0.3 pad 0.41, 0.3 pad 0.61, 0.6)
  Top 0.406: U$2.GPIO4 20.32,71.45 v20.32,74.61 v20.32,76.83 | R12.2 v28.89,78.74 | JP9.3 55.24,66.67 54.61,67.31 47.94,67.31 46.99,66.36 41.59,66.36 v41.27,66.67 | v62.55,65.41 64.14,63.82 64.14,59.37 66.36,57.15 IC2.2 | U1.6 79.29,61.37 v77.15,63.5
  Bottom 0.406: v41.27,66.67 40.64,66.67 39.37,67.94 39.37,69.53 34.29,74.61 v20.32,74.61 | v28.89,78.74 28.89,77.15 28.57,76.83 v20.32,76.83 | JP9.3 56.52,66.99 59.37,66.99 60.96,65.41 v62.55,65.41 62.87,65.72 76.2,65.72 77.15,64.77 v77.15,63.5
  Bottom 0.61: v77.15,63.5 78.74,61.91 82.23,61.91 86.04,65.72 92.39,65.72 93.34,64.77 JP1.3 JP14.3
LED  (via drill 0.3 pad 0.81, 0.6 pad 1.02)
  Top 0.406: R7.1 56.2,62.87 v57.47,64.14
  Top 0.61: IC2.13 71.5,63.88 v71.44,63.18
  Bottom 0.61: v71.44,63.18 64.14,63.18 63.18,64.14 v57.47,64.14
N$1
  Top 0.61: T1.3 OUTPUT2.C 67.41,70.07 66.67,70.8 64.77,70.8 62.55,73.03 D2.A
  Top 0.813: 61.13,72.86 D2.A
  Bottom 1.016: D2.A 63.01,73.03 RELAY2.COIL1
N$2
  Top 0.61: T2.3 OUTPUT1.C
  Top 0.813: 40.81,72.86 D1.A
  Top 1.016: OUTPUT1.C 46.77,70.07 46.04,70.8 44.13,70.8 41.91,73.03 D1.A
  Bottom 1.016: D1.A 42.69,73.03 RELAY1.COIL1
N$3
  Top 1.27: JP3.2 69.29,90.1 71.12,88.27 71.12,73.38 RELAY2.SWCOMMON
N$4
  Top 1.27: JP4.2 54.29,90.49 50.8,87 50.8,73.38 RELAY1.SWCOMMON
N$5
  Top 1.27: JP4.1 59.29,89.63 RELAY1.SWCLOSED
N$6
  Top 1.27: JP4.3 49.29,91.63 RELAY1.SWOPEN
N$7
  Top 1.27: JP3.3 64.29,88.21 RELAY2.SWOPEN
N$8
  Top 1.27: JP3.1 74.29,90.21 RELAY2.SWCLOSED
N$9
  Top 0.61: R3.1 53.98,69.22 53.02,68.26 T2.1
N$10
  Top 0.61: R6.1 74.3,69.22 73.34,68.26 T1.1
N$11
  Top 0.406: R5.2 38.41,53.66 40.96,56.2 40.96,56.62 RESET_BTN.4 41.73,57.38 SJ2.1 41.73,61.86 SJ1.1
N$13
  Top 0.61: OUTPUT2.A R4.2
N$14  (via drill 0.6 pad 0.81)
  Top 0.406: JP11.4 R22.2 | IC2.14 70.23,62.49 71.12,61.59 v76.52,61.59
  Bottom 0.406: v76.52,61.59 77.47,61.59 79.06,60.01 79.06,58.74 80.64,57.15 83.5,57.15 85.41,55.24 JP11.4
N$16
  Top 0.61: LED_USER.A 58.2,61.81 R7.2
N$17
  Top 0.406: OUTPUT1.A 42.86,69.22 R1.2
N$20
  Top 0.61: T4.3 OUTPUT3.C 87.73,70.07 87,70.8 85.41,70.8 83.19,73.03 D4.A
  Top 0.813: 81.45,72.86 D4.A
  Bottom 1.016: D4.A 83.33,73.03 RELAY3.COIL1
N$21
  Top 0.61: R15.1 94.61,69.22 93.66,68.26 T4.1
N$27  (via drill 0.6 pad 0.81)
  Top 0.406: JP11.3 R21.2 | IC2.15 68.96,62.49 70.8,60.64 v75.56,60.64
  Bottom 0.406: v75.56,60.64 80.01,56.2 81.92,56.2 82.87,55.24 JP11.3
N$38
  Top 0.61: U$1.7 13.97,85.41 16.19,83.5 16.19,78.74 16.51,78.42 17.41,78.42 C3.1
  Top 1.016: C3.1 20.59,78.38 Q1.1
N$39
  Top 0.813: R2.2 OUTPUT3.A
N$41
  Top 0.61: U$1.8 14.97,86.68 C5.1
  Top 1.016: C5.1 20.59,84.19 Q1.2
N$42
  Top 1.27: RELAY3.SWCOMMON 91.44,73.38 91.44,88.27 84.28,95.43 JP6.2
N$44
  Top 1.27: JP6.1 89.28,95.54 RELAY3.SWCLOSED
N$45
  Top 1.27: JP6.3 79.28,93.54 RELAY3.SWOPEN
N$46
  Top 0.61: U$1.12 2.54,82.87 JP8.5
N$47
  Top 0.61: U$1.13 2.54,81.6 JP8.4
N$48
  Top 0.61: U$1.14 3.81,80.33 JP8.3
N$49
  Top 0.61: U$1.9 5.88,87.15 JP8.8
N$50
  Top 0.61: U$1.10 5.08,85.41 JP8.7
N$51
  Top 0.61: U$1.11 4.45,84.14 2.54,86.04 JP8.6
N$56
  Top 0.406: R19.2 44.77,59.47 LED_POWER.A
N$60
  Top 0.813: U$2.CSO 32.56,57.29 34.29,55.56 JP16.2
N$61
  Top 0.813: U$2.MISO 33.73,59.29 JP16.4
N$63
  Top 0.813: U$2.GPIO9 34.27,61.29 JP16.6
N$64
  Top 0.813: U$2.GPIO10 34.81,63.29 JP16.8
N$65
  Top 0.813: U$2.MOSI 34.49,65.29 JP16.10
N$66
  Top 0.813: U$2.SCLK 33.95,67.29 JP16.12
N$69  (via drill 0.3 pad 0.81)
  Top 0.406: v28.89,56.2 28.89,58.1 26.67,60.33 25.08,60.33 21.91,63.5 21.91,65.41 v23.18,66.67 | v24.45,67.94 24.45,71.26 U$2.GPIO2 | JP16.1 38.73,55.56 40.01,56.83 40.01,58.1 40.64,58.74 40.64,59.19 SJ2.2
  Top 0.61: U$2.GPIO2 24.48,73.69 R17.1
  Bottom 0.406: JP16.1 35.88,53.98 31.11,53.98 v28.89,56.2 | v23.18,66.67 v24.45,67.94
OUTPUT1
  Top 0.406: R3.2
  Top 0.61: IC2.12 72.77,66.61 72.39,66.99 70.48,66.99 69.85,67.63 58.42,67.63 R3.2
OUTPUT2
  Top 0.61: IC2.11 74.04,66.73 74.61,67.31 76.83,67.31 77.15,67.63 R6.2
OUTPUT3
  Top 0.61: IC2.10 76.99,65.24 79.06,67.31 90.17,67.31 90.81,66.67 93.98,66.67 94.61,67.31 96.84,67.31 97.47,67.94 R15.2
PGRM  (via drill 0.3 pad 0.61)
  Top 0.305: 52.95,59.3 52.95,59.76 52.07,60.64 48.9,60.64 v48.58,60.96 | v28.89,61.91 28.89,62.23 | 22.54,71.23 U$2.GPIO0
  Top 0.406: 28.89,62.23 22.54,68.58 22.54,71.23
  Top 0.813: PGRM_BTN.4 52.95,59.3 R8.1
  Bottom 0.2: 33.34,61.91 39.05,61.91
  Bottom 0.305: v48.58,60.96 48.58,61.91 47.62,62.87 40.01,62.87 39.05,61.91
  Bottom 0.406: v28.89,61.91 33.34,61.91
RESET  (via drill 0.3 pad 0.61, 0.6)
  Top 0.406: U$2.REST 14.48,55.76 v14.61,55.88 | v39.69,59.37 39.69,61.28 40.32,61.91 SJ1.2 40.86,63.09 41.59,63.82 R16.1
  Bottom 0.406: v14.61,55.88 14.61,54.29 15.88,53.02 25.72,53.02 26.04,52.7 39.05,52.7 40.64,54.29 40.64,58.42 v39.69,59.37
SENSOR1  (via drill 0.6 pad 0.81)
  Top 0.406: JP11.2 R14.2 | IC2.16 67.69,62.49 70.48,59.69 v74.3,59.69
  Bottom 0.406: v74.3,59.69 74.93,59.69 80.33,54.29 JP11.2
SENSOR2  (via drill 0.6 pad 0.81)
  Top 0.406: JP11.1 R9.1 | IC2.17 66.39,62.52 v69.85,59.05
  Bottom 0.406: v69.85,59.05 73.03,59.05 77.79,54.29 JP11.1
USB_N
  Top 0.61: U$1.6 10.16,84.14 9.53,84.77 9.53,87 10.16,87.63 15.24,87.63 15.56,87.95 15.56,89.12 JP5.D-
USB_P
  Top 0.61: JP5.D+ 15.54,91.78 14.61,92.71 12.06,92.71 11.11,91.76 11.11,90.17 8.57,87.63 8.57,84.14 9.84,82.87 U$1.5
VCC  (via drill 0.3 pad 0.61, 0.3 pad 0.81, 0.3 pad 1.27, 0.6, 0.6 pad 0.81, 0.6 pad 1.02)
  Top 0.406: U$2.VCC 28.57,53.29 | R8.2 v49.85,59.37 | R10.1 31.75,78.42 JP2.3 31.11,80.38 C7.1 | R21.1 R14.1 R9.2 72.39,58.42 71.6,57.63 | R21.1 R22.1 87.95,58.42 | 71.6,57.63 71.44,57.47 IC2.6 71.48,55.99 C10.1 | 71.6,57.63 71.12,58.1 66.67,58.1 65.09,59.69 v65.09,61.91 | U1.3 83.68,63.82 | 83.68,63.82 U1.2 | 83.68,63.82 83.73,63.77 C9.1 85.41,63.45 R22.1 R21.1 | JP11.5 87.95,58.42 | 87.95,58.42 90.44,58.42 C8.1 90.81,58.78 JP14.2 JP1.2
  Top 0.61: R17.2 R12.1 25.4,81.28 v27.62,83.19 IC3.2 | C4.1 4.45,75.93 4.45,77.15 5.08,77.79 U$1.16 6.99,77.79 7.62,78.42 7.62,80.64 8.57,81.6 v8.89,81.6 U$1.4 | C4.1 JP8.2 | 4.45,75.83 C4.1 | R11.1 v15.24,74.61 | 28.57,53.29 28.57,53.02 36.2,53.02 36.51,52.7 36.51,51.75 v36.83,51.75 | v65.09,61.91 IC2.18 | R20.2 v61.91,59.37
  Top 0.813: IC3.2 27.62,88.58 | IC3.4 27.62,88.58 | 27.62,88.58 C2.+ 34.11,83.63 C7.1 | R5.1 28.75,53.02 U$2.VCC | v15.24,68.58 18.41,65.41 18.41,51.44 v18.48,51.44 U$2.EN
  Bottom 0.61: 16.51,81.6 16.19,81.6 16.19,76.52 15.24,75.56 v15.24,74.61 | 16.51,81.6 25.72,81.6 v27.62,83.19 | 42.55,54.61 43.5,54.61 48.26,59.37 v49.85,59.37 v61.91,59.37 62.87,59.37 v65.09,61.91 | 42.55,54.61 39.69,51.75 v36.83,51.75 18.8,51.75 v18.48,51.44 | JP16.5 41.59,60.64 42.55,59.69 42.55,54.61 | v8.89,81.6 12.06,81.6 13.02,82.55 15.56,82.55 16.51,81.6
  Bottom 0.813: v15.24,68.58 11.43,72.39 6.94,72.39 3.44,75.88 JP8.2
VIN  (via drill 0.3 pad 1.27)
  Top 0.406: JP16.9 38.1,65.72 39.69,67.31 39.69,69.53 | 39.69,69.53 36.2,73.03 36.2,75.25 40.64,79.69 D1.C | R1.1 39.69,69.53
  Top 0.61: R4.1 61.6,69.53 56.83,74.3 56.83,75.17 RELAY1.COIL0 | R2.1 77.15,73.66 77.15,75.17 RELAY2.COIL0
  Top 1.016: v31.75,86.04 29.86,86.04 IC3.3 | C1.+ 31.43,95.89 | 31.43,95.89 27.94,95.89 JP10.2 | C6.1 31.75,95.57 31.43,95.89
  Bottom 0.61: RELAY3.COIL0 97.56,64.68 JP1.5 JP14.5
  Bottom 1.016: D2.C 60.96,79.3 RELAY1.COIL0 | RELAY2.COIL0 81.28,79.3 D4.C | D2.C D1.C 34.61,83.19 v31.75,86.04 | D4.C D2.C | RELAY3.COIL0 97.56,78.33 92.71,83.19 D4.C | JP5.VBUS 13.04,88.25 14.61,86.68 31.11,86.68 v31.75,86.04 | v31.75,86.04 31.75,91.76 JP10.2

### Text on the board
tPlace: ESP8266 / MODULE | v1.1
bPlace: PKA | CTS / DSR / RI / DCD / DTR / RTS / 3.3v / GND / GND / GND / 3.3v / 3.3v / ADC | 5v / SCL / SDA / 3.3v / GND | 15 / SD_2 / MTCK / MTMS / SD_3 / MTDI / MTDO | 2 / 13 / 3.3v / GND / Vin / RX | SDA / SCL / GND | GND / ADC / 3.3 | OSHW | SENSORS / - + 4 3 2 1 | RN+ | WWW.RNPLUS.NL
_bplace: 4